# EAGLE design arcadeController (EAGLE 9.6.2)
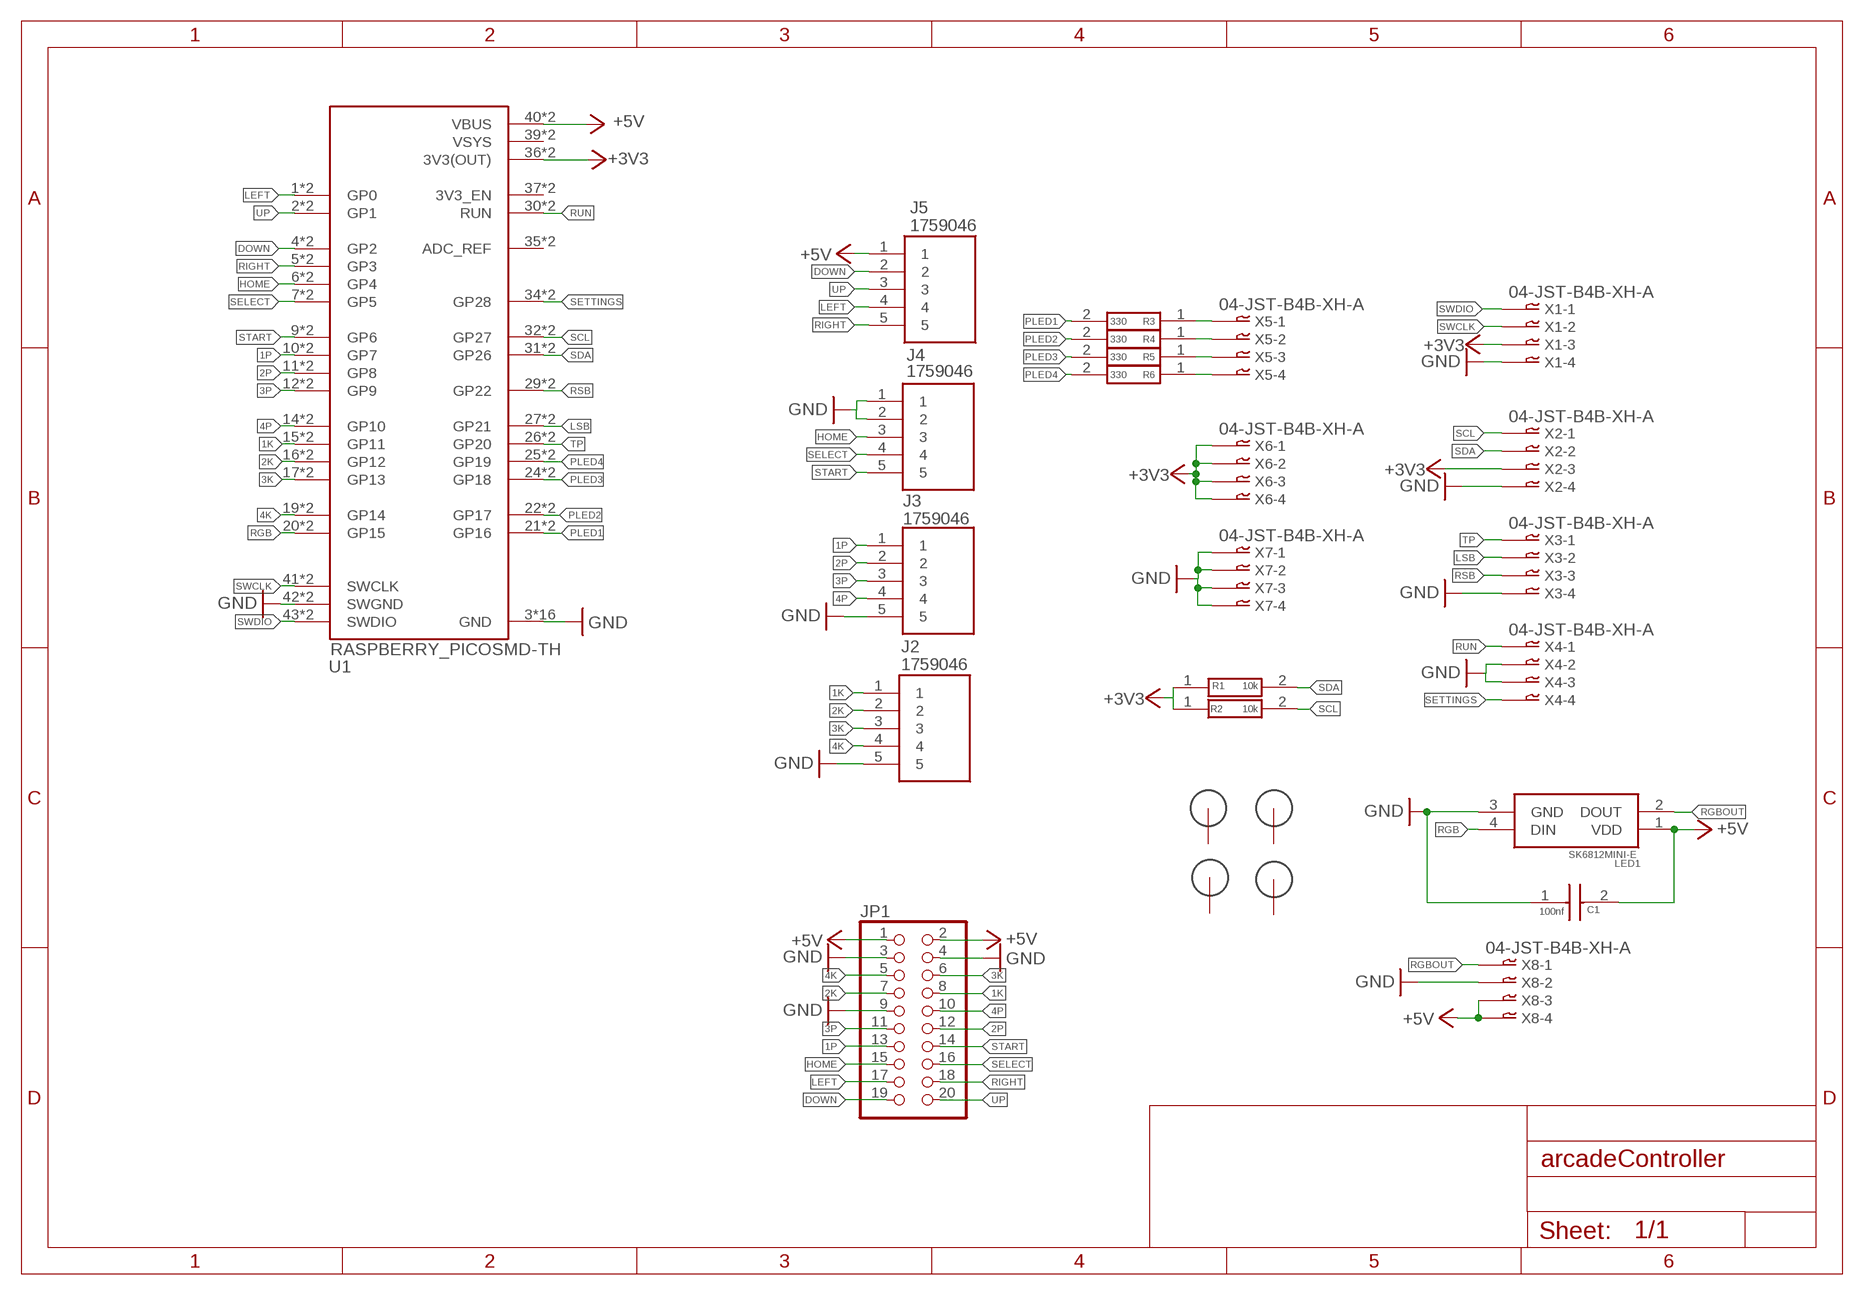
[diagram p0: schematic, sheet 1]

## Parts
C1  100nf  08055C104K4T2A  [CAPC2012X94N]
H1  3MM_HOLE  [3MM_HOLE]
H2  3MM_HOLE  [3MM_HOLE]
H3  3MM_HOLE  [3MM_HOLE]
H4  3MM_HOLE  [3MM_HOLE]
J2  1759046  [SHDRRA5W103P0X508_1X5_2540X120]
J3  1759046  [SHDRRA5W103P0X508_1X5_2540X120]
J4  1759046  [SHDRRA5W103P0X508_1X5_2540X120]
J5  1759046  [SHDRRA5W103P0X508_1X5_2540X120]
JP1  PINHD-2X10  [2X10]
LED1  SK6812MINI-E  [SK6812MINIE]
R1  10k  CHP0805-FX-1002ELF  [RESC2012X60N]
R2  10k  CHP0805-FX-1002ELF  [RESC2012X60N]
R3  330  CMP0603AFX-3300ELF  [RESC1608X55N]
R4  330  CMP0603AFX-3300ELF  [RESC1608X55N]
R5  330  CMP0603AFX-3300ELF  [RESC1608X55N]
R6  330  CMP0603AFX-3300ELF  [RESC1608X55N]
U1  RASPBERRY_PICOSMD-TH  [PICO-PKG]
X1  04-JST-B4B-XH-A  [B4B-XH]
X2  04-JST-B4B-XH-A  [B4B-XH]
X3  04-JST-B4B-XH-A  [B4B-XH]
X4  04-JST-B4B-XH-A  [B4B-XH]
X5  04-JST-B4B-XH-A  [B4B-XH]
X6  04-JST-B4B-XH-A  [B4B-XH]
X7  04-JST-B4B-XH-A  [B4B-XH]
X8  04-JST-B4B-XH-A  [B4B-XH]

## Nets
1K: J2.1 JP1.8 U1.15(GP11) U1.P$15(GP11)
1P: J3.1 JP1.13 U1.10(GP7) U1.P$10(GP7)
2K: J2.2 JP1.7 U1.16(GP12) U1.P$16(GP12)
2P: J3.2 JP1.12 U1.11(GP8) U1.P$11(GP8)
3K: J2.3 JP1.6 U1.17(GP13) U1.P$17(GP13)
3P: J3.3 JP1.11 U1.12(GP9) U1.P$12(GP9)
4K: J2.4 JP1.5 U1.19(GP14) U1.P$19(GP14)
4P: J3.4 JP1.10 U1.14(GP10) U1.P$14(GP10)
+3V3: R1.1 R2.1 U1.36(3V3(OUT)) U1.P$36(3V3(OUT)) X1.P$3 X2.P$3 X6.P$1 X6.P$2 X6.P$3 X6.P$4
+5V: C1.2 J5.1 JP1.1 JP1.2 LED1.1(VDD) U1.40(VBUS) U1.P$40(VBUS) X8.P$3 X8.P$4
DOWN: J5.2 JP1.19 U1.4(GP2) U1.P$4(GP2)
GND: C1.1 J2.5 J3.5 J4.1 J4.2 JP1.3 JP1.4 JP1.9 LED1.3(GND) U1.3(GND) U1.8(GND) U1.13(GND) U1.18(GND) U1.23(GND) U1.28(GND) U1.33(GND) U1.38(GND) U1.42(SWGND) U1.P$3(GND) U1.P$8(GND) U1.P$13(GND) U1.P$18(GND) U1.P$23(GND) U1.P$28(GND) U1.P$33(GND) U1.P$38(GND) U1.P$42(SWGND) X1.P$4 X2.P$4 X3.P$4 X4.P$2 X4.P$3 X7.P$1 X7.P$2 X7.P$3 X7.P$4 X8.P$2
HOME: J4.3 JP1.15 U1.6(GP4) U1.P$6(GP4)
LEFT: J5.4 JP1.17 U1.1(GP0) U1.P$1(GP0)
LSB: U1.27(GP21) U1.P$27(GP21) X3.P$2
N$21: R3.1 X5.P$1
N$22: R4.1 X5.P$2
N$23: R5.1 X5.P$3
N$24: R6.1 X5.P$4
PLED1: R3.2 U1.21(GP16) U1.P$21(GP16)
PLED2: R4.2 U1.22(GP17) U1.P$22(GP17)
PLED3: R5.2 U1.24(GP18) U1.P$24(GP18)
PLED4: R6.2 U1.25(GP19) U1.P$25(GP19)
RGB: LED1.4(DIN) U1.20(GP15) U1.P$20(GP15)
RGBOUT: LED1.2(DOUT) X8.P$1
RIGHT: J5.5 JP1.18 U1.5(GP3) U1.P$5(GP3)
RSB: U1.29(GP22) U1.P$29(GP22) X3.P$3
RUN: U1.30(RUN) U1.P$30(RUN) X4.P$1
SCL: R2.2 U1.32(GP27) U1.P$32(GP27) X2.P$1
SDA: R1.2 U1.31(GP26) U1.P$31(GP26) X2.P$2
SELECT: J4.4 JP1.16 U1.7(GP5) U1.P$7(GP5)
SETTINGS: U1.34(GP28) U1.P$34(GP28) X4.P$4
START: J4.5 JP1.14 U1.9(GP6) U1.P$9(GP6)
SWCLK: U1.41(SWCLK) U1.P$41(SWCLK) X1.P$2
SWDIO: U1.43(SWDIO) U1.P$43(SWDIO) X1.P$1
TP: U1.26(GP20) U1.P$26(GP20) X3.P$1
UP: J5.3 JP1.20 U1.2(GP1) U1.P$2(GP1)
Unconnected: H1.P$1(GND) H1.P$2(GND) H1.P$3(GND) H1.P$4(GND) H1.P$5(GND) H1.P$6(GND) H1.P$7(GND) H1.P$8(GND) H1.P$9(GND) H2.P$1(GND) H2.P$2(GND) H2.P$3(GND) H2.P$4(GND) H2.P$5(GND) H2.P$6(GND) H2.P$7(GND) H2.P$8(GND) H2.P$9(GND) H3.P$1(GND) H3.P$2(GND) H3.P$3(GND) H3.P$4(GND) H3.P$5(GND) H3.P$6(GND) H3.P$7(GND) H3.P$8(GND) H3.P$9(GND) H4.P$1(GND) H4.P$2(GND) H4.P$3(GND) H4.P$4(GND) H4.P$5(GND) H4.P$6(GND) H4.P$7(GND) H4.P$8(GND) H4.P$9(GND) U1.35(ADC_REF) U1.37(3V3_EN) U1.P$35(ADC_REF) U1.P$37(3V3_EN)

## Power pins joined to a net without a drawn wire
VSYS: U1.39(VSYS) U1.P$39(VSYS)

## Library data of the parts
C1 = 08055C104K4T2A:08055C104K4T2A: AVX - 08055C104K4T2A - SMD Multilayer Ceramic Capacitor, 0.1 F, 50 V, 0805 [2012 Metric], +/- 10%, X7R Source: Datasheet <https://componentsearchengine.com/Datasheets/2/08055C104K4T2A.pdf>; DESCRIPTION: AVX - 08055C104K4T2A - SMD Multilayer Ceramic Capacitor, 0.1 F, 50 V, 0805 [2012 Metric], +/- 10%, X7R; HEIGHT: 0.94mm; MANUFACTURER_NAME: Kyocera AVX; MANUFACTURER_PART_NUMBER: 08055C104K4T2A; MOUSER_PART_NUMBER: 581-08055C104K4; MOUSER_PRICE-STOCK: https://www.mouser.co.uk/ProductDetail/KYOCERA-AVX/08055C104K4T2A?qs=xMTsDkQFXIwOG0s%252Bx1urSg%3D%3D
H1-H4 = 3mm_special_hole:3MM_HOLE: Cool looking 3mm hole with ground connection
J2-J5 = 1759046:1759046: PCB header, nominal cross section: 2.5 mm?, color: green, nominal current: 12 A, rated voltage (III/2): 320 V, contact surface: Tin, type of contact: Male connector, Number of potentials: 5, Number of rows: 1, Number of positions per row: 5, number of connections: 5, product range: MSTB 2,5/..-G, pitch: 5.08 mm, mounting: Wave soldering, pin layout: Linear pinning, solder pin [P]: 3.2 mm, Stecksystem: CLASSIC COMBICON, Locking: without, type of packaging: packed in cardboard Source: Datasheet <http://www.phoenixcontact.com/de/produkte/1759046/pdf>; DESCRIPTION: PCB header, nominal cross section: 2.5 mm?, color: green, nominal current: 12 A, rated voltage (III/2): 320 V, contact surface: Tin, type of contact: Male connector, Number of potentials: 5, Number of rows: 1, Number of positions per row: 5, number of connections: 5, product range: MSTB 2,5/..-G, pitch: 5.08 mm, mounting: Wave soldering, pin layout: Linear pinning, solder pin [P]: 3.2 mm, Stecksystem: CLASSIC COMBICON, Locking: without, type of packaging: packed in cardboard; HEIGHT: 8.72mm; MANUFACTURER_NAME: Phoenix Contact; MANUFACTURER_PART_NUMBER: 1759046; MOUSER_PART_NUMBER: 651-1759046; MOUSER_PRICE-STOCK: https://www.mouser.co.uk/ProductDetail/Phoenix-Contact/1759046?qs=cyzODkzcbwC75vUJEckceg%3D%3D
JP1 = pinhead:PINHD-2X10: PIN HEADER
LED1 = SK6812MINI-E:SK6812MINI-E: 3.2x2.8x1.78 mm 0.2W Intelligent external control surface mount SMD LED (MSL:5a) Source: Datasheet <http://yushakobo.jp/ds/YS-SK6812MINI-E.pdf>; DESCRIPTION: 3.2x2.8x1.78 mm 0.2W Intelligent external control surface mount SMD LED (MSL:5a); HEIGHT: 1.88mm; MANUFACTURER_NAME: Yellow Stone Corp.; MANUFACTURER_PART_NUMBER: SK6812MINI-E
R1 R2 = CHP0805-FX-1002ELF:CHP0805-FX-1002ELF: Thick Film Resistors - SMD ResHighPower 0805 10k 1% 1/2W TC100 Source: Datasheet <https://ms.componentsearchengine.com/Datasheets/1/CHP0805-FX-1002ELF.pdf>; DESCRIPTION: Thick Film Resistors - SMD ResHighPower 0805 10k 1% 1/2W TC100; HEIGHT: 0.6mm; MANUFACTURER_NAME: Bourns; MANUFACTURER_PART_NUMBER: CHP0805-FX-1002ELF; MOUSER_PART_NUMBER: 652-CHP0805FX1002ELF; MOUSER_PRICE-STOCK: https://www.mouser.co.uk/ProductDetail/Bourns/CHP0805-FX-1002ELF?qs=lc2O%252BfHJPVaDI6gsPdDtfw%3D%3D
R3-R6 = CMP0603AFX-3300ELF:CMP0603AFX-3300ELF: Thick Film Resistors - SMD 330 OHM 1% 1/4W TC100 Source: Datasheet <https://www.bourns.com/docs/Product-Datasheets/CMP-A.pdf>; DESCRIPTION: Thick Film Resistors - SMD 330 OHM 1% 1/4W TC100; HEIGHT: 0.55mm; MANUFACTURER_NAME: Bourns; MANUFACTURER_PART_NUMBER: CMP0603AFX-3300ELF; MOUSER_PART_NUMBER: 652-CMP0603AFX-3300L; MOUSER_PRICE-STOCK: https://www.mouser.co.uk/ProductDetail/Bourns/CMP0603AFX-3300ELF?qs=TiOZkKH1s2QD9kDdDwF%252BdA%3D%3D
U1 = RpiPico:RASPBERRY_PICO: Raspberry Pi Pico
X1-X8 = bt_con-jst-xh:04-JST: JST CONNECTOR

## Board
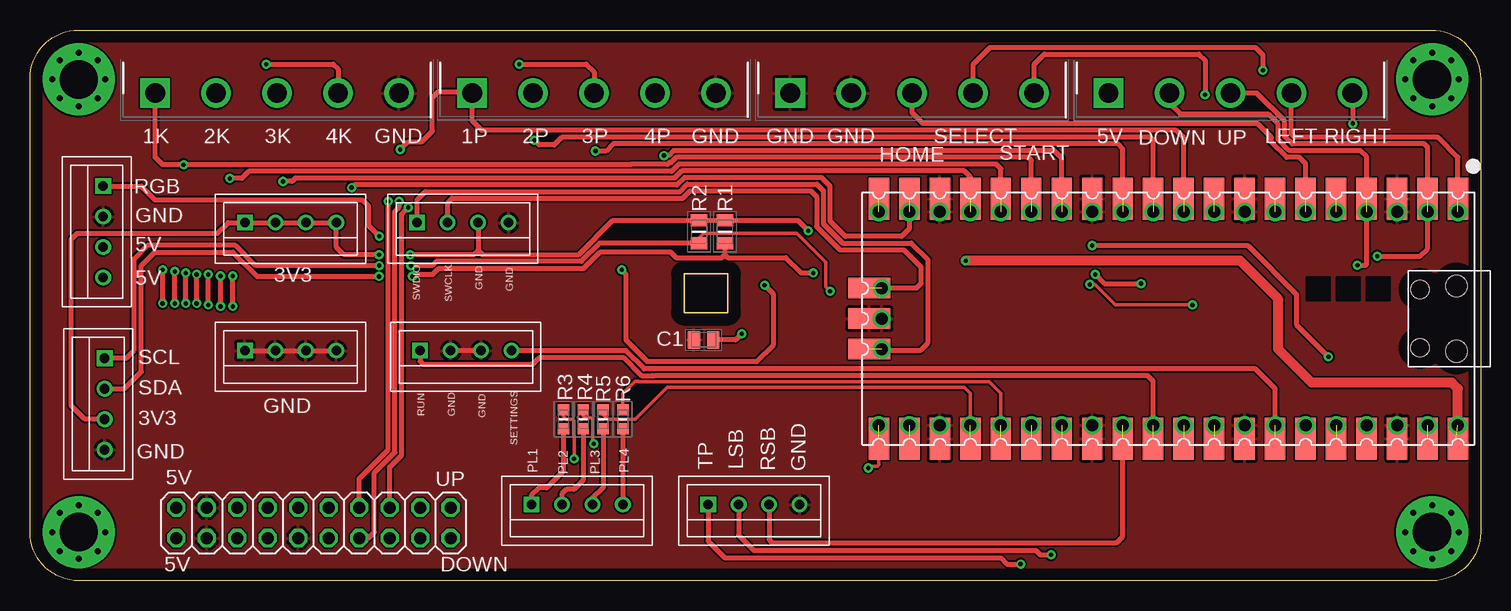
[diagram p1: board, top side]
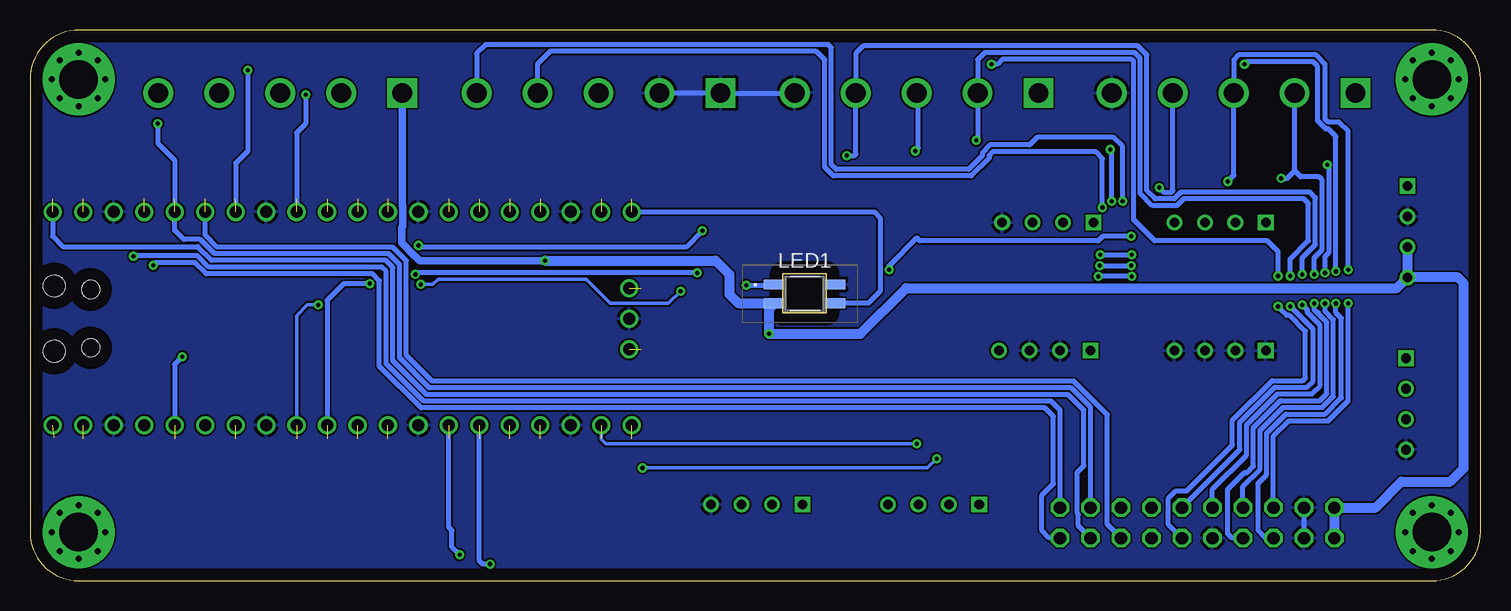
[diagram p2: board, bottom side, seen from below]

Size 120.89 x 45.9 mm. Coordinates in mm from the lower left corner, seen from the top.
Outline: 0,41.83 arc-90 4.06,45.9 116.78,45.9 arc-90 120.89,41.78 120.89,4.05 arc-90 116.84,0 4.06,0 arc-90 0,4.06 0,41.83
Copper layers (1*16): Top 0.035mm / dielectric 1.5mm / Bottom 0.035mm
Design rules "default *": minimum track width 6mil, minimum drill 0.35mm, track to track 6mil, track to pad 6mil, pad to pad 6mil, via to via 6mil, smd to smd 6mil, copper to edge 40mil, drill to drill 6mil, minimum pad ring 10mil, minimum via ring 8mil, stop-mask expansion 4mil, vias tented up to drill 0.36mm, thermal gap 10mil

### Footprints (pad centres in the part's own frame; a part is rotated, then mirrored left to right if it is on the bottom)
CAPC2012X94N = smd 1.02 x 1.47: 1 -0.81,0; 2 0.81,0
3MM_HOLE = drill 3.2 pad 6: P$1 0,0 | drill 0.5 pad 0.61: P$2 0,2.223; P$3 0,-2.223; P$4 2.223,0; P$5 -2.223,0; P$6 -1.587,1.587; P$7 1.587,1.587; P$8 1.587,-1.587; P$9 -1.587,-1.587
SHDRRA5W103P0X508_1X5_2540X120 = drill 1.65 pad 2.475 square: 1 0,0 | drill 1.65 pad 2.475: 2 5.08,0; 3 10.16,0; 4 15.24,0; 5 20.32,0
2X10 = drill 1.016 octagon: 1 -11.43,-1.27; 2 -11.43,1.27; 3 -8.89,-1.27; 4 -8.89,1.27; 5 -6.35,-1.27; 6 -6.35,1.27; 7 -3.81,-1.27; 8 -3.81,1.27; 9 -1.27,-1.27; 10 -1.27,1.27; 11 1.27,-1.27; 12 1.27,1.27; 13 3.81,-1.27; 14 3.81,1.27; 15 6.35,-1.27; 16 6.35,1.27; 17 8.89,-1.27; 18 8.89,1.27; 19 11.43,-1.27; 20 11.43,1.27
SK6812MINIE = smd 1.8 x 0.82: 1 -2.5,-0.774; 2 -2.5,0.774; 3 2.5,0.774; 4 2.5,-0.774
RESC2012X60N = smd 1 x 1.4: 1 -0.95,0; 2 0.95,0
RESC1608X55N = smd 0.9 x 0.95: 1 -0.8,0; 2 0.8,0
PICO-PKG = drill 1: 1 -8.89,24.13; 2 -8.89,21.59; 3 -8.89,19.05; 4 -8.89,16.51; 5 -8.89,13.97; 6 -8.89,11.43; 7 -8.89,8.89; 8 -8.89,6.35; 9 -8.89,3.81; 10 -8.89,1.27; 11 -8.89,-1.27; 12 -8.89,-3.81; 13 -8.89,-6.35; 14 -8.89,-8.89; 15 -8.89,-11.43; 16 -8.89,-13.97; 17 -8.89,-16.51; 18 -8.89,-19.05; 19 -8.89,-21.59; 20 -8.89,-24.13; 21 8.89,-24.13; 22 8.89,-21.59; 23 8.89,-19.05; 24 8.89,-16.51; 25 8.89,-13.97; 26 8.89,-11.43; 27 8.89,-8.89; 28 8.89,-6.35; 29 8.89,-3.81; 30 8.89,-1.27; 31 8.89,1.27; 32 8.89,3.81; 33 8.89,6.35; 34 8.89,8.89; 35 8.89,11.43; 36 8.89,13.97; 37 8.89,16.51; 38 8.89,19.05; 39 8.89,21.59; 40 8.89,24.13; 41 -2.54,-23.9; 42 0,-23.9; 43 2.54,-23.9 | smd 3.5 x 1.7: P$1 -10,24.13; P$2 -10,21.59; P$3 -10,19.05; P$4 -10,16.51; P$5 -10,13.97; P$6 -10,11.43; P$7 -10,8.89; P$8 -10,6.35; P$9 -10,3.81; P$10 -10,1.27; P$11 -10,-1.27; P$12 -10,-3.81; P$13 -10,-6.35; P$14 -10,-8.89; P$15 -10,-11.43; P$16 -10,-13.97; P$17 -10,-16.51; P$18 -10,-19.05; P$19 -10,-21.59; P$20 -10,-24.13; P$21 10,-24.13; P$22 10,-21.59; P$23 10,-19.05; P$24 10,-16.51; P$25 10,-13.97; P$26 10,-11.43; P$27 10,-8.89; P$28 10,-6.35; P$29 10,-3.81; P$30 10,-1.27; P$31 10,1.27; P$32 10,3.81; P$33 10,6.35; P$34 10,8.89; P$35 10,11.43; P$36 10,13.97; P$37 10,16.51; P$38 10,19.05; P$39 10,21.59; P$40 10,24.13 | smd 1.7 x 3.5: P$41 -2.54,-24.925; P$42 0,-24.925; P$43 2.54,-24.925 | hole 1.8: -2.725,24; 2.725,24 | hole 1.5: -2.425,20.97; 2.425,20.97
B4B-XH = drill 0.8 square: P$1 3.81,0 | drill 0.8: P$2 1.27,0; P$3 -1.27,0; P$4 -3.81,0

### Placement (x,y rotation side)
C1  56.13,20.07 0 top
H1  4.06,4.06 0 top
H2  116.84,41.78 0 top
H3  116.84,4.06 0 top
H4  4.06,41.78 0 top
J2  10.43,40.64 0 top
J3  36.84,40.65 0 top
J4  63.35,40.64 0 top
J5  89.88,40.64 0 top
JP1  23.62,4.83 0 top
LED1  56.35,23.91 0 bottom
R1  57.91,29.08 270 top
R2  55.75,29.08 270 top
R3  44.45,13.46 90 top
R4  46.1,13.46 90 top
R5  47.75,13.46 90 top
R6  49.4,13.46 90 top
U1  94.87,21.84 270 top
X1  36.07,29.84 180 top
X2  6.22,14.73 90 top
X3  60.33,6.35 180 top
X4  36.32,19.18 180 top
X5  45.59,6.35 180 top
X6  21.72,29.84 180 top
X7  21.72,19.18 180 top
X8  6.1,29.08 90 top

### Tracks (layer width: path | path; a pad name or v marks a point on that pad's centre or on a via)
1K  (via drill 0.35)  (1 unrouted)
  Top 0.406: U1.P$15 83.44,35.03 83.19,35.28 53.85,35.28 53.44,34.87 53.31,34.87 53.14,34.7 50.07,34.7 50.04,34.67 v12.8,34.67 11.05,34.67 10.43,35.29 J2.1 | v12.97,23.11 v12.97,25.65
  Bottom 0.406: JP1.8 19.81,7.87 18.39,9.3 18.39,12.53 16.47,14.45 13.19,14.45 12.27,15.37 12.27,21.77 12.97,22.47 v12.97,23.11 | v12.97,25.65 12.97,27.03 12.62,27.38 12.62,34.5 v12.8,34.67
1P  (via drill 0.35)  (1 unrouted)
  Top 0.406: U1.P$10 96.14,36.91 95.5,37.54 37.64,37.54 36.84,38.34 J3.1 36.73,40.77 34.04,40.77 33.53,40.26 33.53,37.47 32.64,36.58 31.5,36.58 v30.86,35.94 | JP1.13 28.19,3.56 28.7,4.06 28.7,8.99 30.4,10.69 30.4,30.79 30.75,31.13 v30.75,31.62
  Bottom 0.406: v30.86,35.94 30.75,35.83 v30.75,31.62
2K  (via drill 0.35)  (1 unrouted)
  Top 0.406: U1.P$16 80.9,34.34 80.52,34.72 54.08,34.72 53.47,34.11 18.24,34.11 17.65,33.53 v16.64,33.53 | v13.88,23.11 v13.88,25.53
  Bottom 0.406: v16.64,33.53 16.13,33.53 15.51,34.15 | 15.51,34.15 J2.2 | JP1.7 20.7,3.56 21.08,3.94 21.08,7.62 19.69,9.02 19.46,9.02 18.95,9.53 18.95,12.76 16.7,15.01 13.42,15.01 12.83,15.6 12.83,21.54 13.53,22.24 | 13.53,22.24 13.53,22.35 | 13.53,22.24 13.88,22.59 v13.88,23.11 | v13.88,25.53 13.88,26.91 13.21,27.59 13.21,33.4 13.46,33.66 15.01,33.66 15.51,34.15
2P  (via drill 0.35)  (1 unrouted)
  Top 0.406: U1.P$11 93.6,36.7 93.35,36.96 44.32,36.96 43.69,36.32 42.42,36.32 v42.04,36.7 | v15.88,22.86 v15.88,25.4
  Bottom 0.406: v42.04,36.7 41.92,36.82 J3.2 41.92,43.42 41.33,44.02 28.83,44.02 28.37,43.56 28.37,32.28 27.36,31.27 25.32,31.27 24.76,31.83 14.73,31.83 14.35,31.45 14.35,28.32 15.88,26.8 v15.88,25.4 | JP1.12 20.07,10.92 20.07,13.22 17.16,16.13 14.48,16.13 13.97,16.64 13.97,20.95 v15.88,22.86
3K  (via drill 0.35)  (1 unrouted)
  Top 0.406: U1.P$17 78.36,33.66 77.85,34.16 54.31,34.16 53.7,33.55 22.12,33.55 21.84,33.27 v21.08,33.27 | v11.05,23.11 v11.05,25.91
  Bottom 0.406: v21.08,33.27 20.57,33.78 20.57,40.63 | 20.57,40.63 J2.3 | JP1.6 17.27,12.06 16,13.34 12.7,13.34 11.05,14.99 v11.05,23.11 | v11.05,25.91 11.05,37.47 11.81,38.23 12.7,38.23 12.95,38.48 12.95,43.05 13.72,43.81 20.19,43.81 20.57,43.43 20.57,40.63
3P  (via drill 0.35)  (1 unrouted)
  Top 0.406: U1.P$12 91.06,36.02 90.68,36.4 48.59,36.4 48.01,35.81 v47.12,35.81 | v16.89,22.86 v16.89,25.4 | v40.77,43.05 46.36,43.05 47,42.41 J3.3
  Bottom 0.406: v47.12,35.81 46.86,36.07 46.86,40.51 J3.3 | JP1.11 26.03,4.7 26.03,6.86 25.4,7.49 24.51,7.49 20.7,11.3 20.7,13.38 17.39,16.69 14.81,16.69 14.6,16.89 14.6,20.8 15.93,22.13 16.18,22.13 16.61,22.56 16.61,22.58 v16.89,22.86 | v16.89,25.4 16.89,27.43 17.78,28.32 27.18,28.32 28.93,30.07 28.93,43.33 29.06,43.46 39.85,43.46 40.26,43.05 v40.77,43.05
4K  (via drill 0.35)  (1 unrouted)
  Top 0.406: U1.P$19 73.28,29.34 72.64,28.7 67.95,28.7 66.67,29.97 66.67,32.89 65.96,33.6 54.55,33.6 53.94,32.99 27.03,32.99 v26.8,32.77 | v12.06,23.11 v12.06,25.78 | v19.69,43.05 25.27,43.05 25.67,42.66 J2.4
  Bottom 0.406: v26.8,32.77 26.42,32.38 25.78,32.38 25.65,32.51 25.65,40.63 J2.4 | JP1.5 17.91,3.56 18.54,4.19 18.54,8.13 17.83,8.84 17.83,12.3 16.23,13.89 12.95,13.89 11.61,15.24 11.61,21.9 12.06,22.35 v12.06,23.11 | v12.06,25.78 12.06,37.03 12.7,37.67 12.93,37.67 13.59,38.33 13.59,42.88 13.97,43.26 19.48,43.26 v19.69,43.05
4P  (via drill 0.35)  (1 unrouted)
  Top 0.406: U1.P$14 85.98,35.2 85.34,35.84 53.62,35.84 53.21,35.43 v52.83,35.43 | v14.86,22.99 v14.86,25.53
  Bottom 0.406: v52.83,35.43 52.2,35.43 52.07,35.56 52.07,40.39 52.07,40.64 | 52.07,40.64 J3.4 | JP1.10 22.35,7.62 19.51,10.47 19.51,12.99 16.93,15.57 14.07,15.57 13.39,16.26 13.39,21.3 14.44,22.36 14.44,22.57 v14.86,22.99 | v14.86,25.53 14.86,26.92 13.77,28.02 13.77,31.93 14.22,32.38 24.99,32.38 25.55,31.83 27.13,31.83 27.81,32.51 27.81,43.81 28.58,44.58 51.44,44.58 52.07,43.94 52.07,40.64
+3V3  (via drill 0.35)  (1 unrouted)
  Top 0.406: X1.P$3 37.34,27.56 | v31.7,27.18 36.96,27.18 37.34,27.56 | v29.08,27.18 26.16,27.18 25.53,27.81 X6.P$4 X6.P$3 X6.P$2 X6.P$1 16.51,29.84 15.62,28.96 3.94,28.96 3.43,28.45 3.43,14.61 4.57,13.46 X2.P$3 | 37.34,27.56 37.72,27.18 45.72,27.18 48.58,30.03 R2.1 R1.1 64,30.03 v64.86,29.17 | v88.52,27.94 101.47,27.94 105.54,23.88 105.54,21.34 v108.2,18.67
  Bottom 0.406: v31.7,27.18 v29.08,27.18 | v64.86,29.17 66.22,27.81 88.39,27.81 v88.52,27.94 | v108.2,18.67 108.84,18.03 U1.36
+5V  (via drill 0.35)  (1 unrouted)
  Top 0.406: v59.31,20.57 58.8,20.07 C1.2 | 118.87,11.97 U1.P$40
  Top 0.813: U1.P$40 119,16 118.49,16.51 106.81,16.51 104.01,19.3 104.01,23.49 100.84,26.67 v77.98,26.67
  Bottom 0.61: J5.1 89.88,31.27 89.85,31.24 89.85,29.53 89.92,29.46 89.92,28.16 88.86,27.11 88.83,27.11 88.39,26.67 v77.98,26.67
  Bottom 0.813: v77.98,26.67 63.75,26.67 62.61,25.53 62.61,23.88 61.88,23.14 LED1.1 59.31,22.68 v59.31,20.57 51.69,20.57 47.88,24.38 6.98,24.38 X8.P$4 | X8.P$4 X8.P$3 | JP1.1 JP1.2 8.76,6.1 6.6,8.26 2.54,8.26 1.42,9.37 1.42,24.79 1.91,25.27 X8.P$4
DOWN  (via drill 0.35)  (1 unrouted)
  Top 0.406: U1.P$4 111.38,35.33 110.87,35.84 104.95,35.84 104,36.79 104,38.08 103.22,38.86 95.89,38.86 94.96,39.79 J5.2 | v110.62,26.29 111.25,26.29 111.38,26.42 U1.4
  Bottom 0.406: JP1.19 35.94,3.56 36.58,4.19 36.58,7.11 35.61,8.08 35.61,13.69 36.32,14.4 88.3,14.4 91.77,17.87 91.77,25.02 92.33,25.58 106.21,25.58 107.14,26.51 110.39,26.51 v110.62,26.29
GND
  Top 0.406: X4.P$3 X4.P$2 | X7.P$4 X7.P$3 X7.P$2 X7.P$1
  Bottom 0.406: J4.2 J4.1 57.17,40.64 J3.5 | JP1.4 JP1.3
  pour Top: 0.51,46.74 123.32,46.74 123.32,31.75 123.32,-1.27 114.68,-1.27 -1.78,-1.27 -1.78,16.89 -1.78,46.74
  pour Bottom: -1.78,46.74 123.32,46.74 123.32,37.21 123.32,-1.27 117.6,-1.27 -1.78,-1.27 -1.78,3.68
HOME  (1 unrouted)
  Top 0.406: U1.P$6 106.3,34.77 105.79,35.28 104.72,35.28 103.44,36.56 103.44,36.96 102.3,38.1 74.42,38.1 73.51,39.01 J4.3
  Bottom 0.406: JP1.15 31.11,4.7 31.11,13.84 33.91,16.64 87.38,16.64 89.54,18.8 89.54,26.67 90.68,27.81 105.28,27.81 106.3,28.83 U1.6
LEFT  (1 unrouted)
  Top 0.406: U1.P$1 119,35.31 117.35,36.96 105.41,36.96 105.12,37.25 J5.4
  Bottom 0.406: JP1.17 33.53,4.57 33.53,5.53 33.63,5.63 33.63,9.04 33.07,9.6 33.07,14.22 34.37,15.52 87.84,15.52 90.65,18.33 90.65,26.11 91.24,26.7 105.75,26.7 106.9,27.85 118.14,27.85 119,28.7 U1.1
LSB  (via drill 0.35)  (1 unrouted)
  Top 0.406: X3.P$2 59.06,3.81 60.33,2.54 83.82,2.54 84.2,2.16 v85.09,2.16
  Bottom 0.406: v85.09,2.16 85.72,2.79 85.72,4.19 85.98,4.45 U1.27
N$21
  Top 0.406: R3.1 44.45,9.14 43.05,7.75 42.42,7.75 41.78,7.11 X5.P$1
N$22
  Top 0.406: R4.1 46.1,8.38 45.34,7.62 44.7,7.62 44.32,7.24 X5.P$2
N$23
  Top 0.406: R5.1 47.75,7.75 46.86,6.86 X5.P$3
N$24
  Top 0.406: R6.1 X5.P$4
PLED1  (via drill 0.35)  (1 unrouted)
  Top 0.305: U1.P$21 70.74,9.65 70.61,9.52 69.85,9.52 v69.85,9.4 | v45.34,10.16 45.34,12.07 45.32,12.09 45.32,13.35 45.21,13.46 44.7,13.46 44.45,13.72 R3.2
  Bottom 0.305: v69.85,9.4 46.1,9.4 v45.34,10.16
PLED2  (via drill 0.35)  (1 unrouted)
  Top 0.305: R4.2 46.1,13.72 46.23,13.59 46.74,13.59 46.88,13.44 46.88,11.54 v46.99,11.43
  Bottom 0.305: v46.99,11.43 72.9,11.43 73.28,11.81 U1.22
PLED3  (1 unrouted)
  Top 0.305: U1.P$24 78.36,15.62 77.85,16.13 53.09,16.13 50.42,13.46 48.13,13.46 47.75,13.84 R5.2
PLED4  (1 unrouted)
  Top 0.305: U1.P$25 80.9,15.62 79.93,16.59 50.74,16.59 50.69,16.64 50.42,16.64 49.4,15.62 R6.2
RGB  (1 unrouted)
  Bottom 0.152: 53.24,23.37 53.19,23.37 52.96,23.14 53.36,23.14 LED1.4
  Bottom 0.406: U1.20 50.55,30.73 50.04,30.23 50.04,24.13 51.03,23.14 52.45,23.14 52.96,23.14 53.24,23.14 53.24,23.37
RGBOUT  (via drill 0.35)
  Top 0.406: X8.P$1 9.27,32.89 10.41,31.75 27.69,31.75 28.19,31.24 28.19,29.62 v29.11,28.7 | v49.3,25.91 49.66,25.55 49.66,20.07 51.44,18.29 60.58,18.29 61.98,19.69 61.98,23.88 v61.21,24.64
  Bottom 0.305: 59.43,24.54 59.38,24.59 59.38,24.69 59.43,24.64 | LED1.2 59.43,24.69
  Bottom 0.406: v29.11,28.7 31.5,28.7 31.88,28.32 46.74,28.32 46.99,28.58 49.3,26.26 v49.3,25.91 | v61.21,24.64 59.48,24.64 59.43,24.69 59.43,24.64
RIGHT  (via drill 0.35)  (1 unrouted)
  Top 0.406: J5.5 110.24,40.6 v110.24,38.1
  Bottom 0.406: v110.24,38.1 110.24,36.45 108.84,35.05 U1.5 108.84,29.21 108.08,28.45 106.71,28.45 105.51,27.25 91.01,27.25 90.09,26.34 90.09,18.56 87.61,16.08 34.14,16.08 32.51,14.45 JP1.18
RSB  (1 unrouted)
  Top 0.406: X3.P$3 61.59,3.43 61.85,3.17 90.55,3.17 91.06,3.68 U1.P$29
RUN  (1 unrouted)
  Top 0.406: X4.P$1 32.51,18.29 32.77,18.03 41.91,18.03 42.49,18.62 49.43,18.62 50.95,17.09 51.82,17.09 52.07,17.09 93.14,17.09 93.6,16.64 U1.P$30
SCL  (via drill 0.35)  (1 unrouted)
  Top 0.305: v96.87,22.99 90.42,22.99 88.72,24.69 v88.32,24.69 | v66.67,24.13 66.29,24.51 66.29,26.54 63.88,28.96 56.13,28.96 55.75,28.58 R2.2
  Top 0.406: R2.2 47.47,28.13 45.95,26.62 33.86,26.62 33.51,26.27 v31.75,26.27 | v29.11,26.27 18.82,26.27 17.15,27.94 9.78,27.94 8.64,26.8 8.64,19.18 8,18.54 X2.P$1
  Bottom 0.305: U1.32 98.68,22.1 97.79,22.99 v96.87,22.99 | v88.32,24.69 87.32,24.69 86.87,25.15 74.55,25.15 72.52,23.11 67.69,23.11 v66.67,24.13
  Bottom 0.406: v31.75,26.27 v29.11,26.27
SDA  (via drill 0.35)  (1 unrouted)
  Top 0.406: X2.P$2 7.87,16 9.27,17.4 9.27,26.24 10.41,27.38 16.91,27.38 18.93,25.36 v29.08,25.36 | v31.88,25.36 32.05,25.54 33.56,25.54 34.06,26.04 46.16,26.04 47.53,27.4 53.37,27.4 53.85,26.92 57.66,26.92 57.91,27.18 | R1.2 57.91,27.18 | 57.91,27.18 58.17,26.92 62.99,26.92 64.26,25.65 v65.28,25.65 | v88.77,25.53 89.54,24.77 v92.58,24.77
  Bottom 0.406: v29.08,25.36 v31.88,25.36 | v65.28,25.65 88.65,25.65 v88.77,25.53 | v92.58,24.77 94.74,24.77 96.14,23.37 U1.31
SELECT  (via drill 0.35)  (1 unrouted)
  Top 0.406: J4.4 78.59,43.03 80.01,44.45 102.11,44.45 102.74,43.81 v102.74,42.55 | v31.52,31.11 30.96,30.55 30.96,10.46 29.97,9.47 JP1.16
  Bottom 0.406: v102.74,42.55 102.74,35.81 103.76,34.8 U1.7 | v31.52,31.11 31.52,35.21 32.05,35.74 40.69,35.74 40.97,35.46 40.97,35.2 42.44,33.73 53.95,33.73 54.66,34.44 54.66,43.41 55.37,44.12 77.55,44.12 78.61,43.05 78.61,40.67 J4.4
SETTINGS  (1 unrouted)
  Top 0.406: U1.P$34 103.76,16 102.11,17.65 51.18,17.65 49.66,19.18 X4.P$4
START  (via drill 0.35)  (1 unrouted)
  Top 0.406: J4.5 83.67,43.03 84.53,43.89 97.41,43.89 97.92,43.38 v97.92,40.51 | JP1.14 27.43,8.51 29.84,10.92 v29.84,31.62
  Bottom 0.406: v97.92,40.51 97.92,38.1 98.68,37.34 U1.9 | J4.5 83.67,43.94 82.93,44.68 54.36,44.68 54.1,44.42 54.1,34.67 53.72,34.29 42.67,34.29 41.53,35.43 41.53,35.69 40.89,36.32 37.59,36.32 36.96,36.96 30.61,36.96 29.84,36.2 v29.84,31.62
SWCLK  (1 unrouted)
  Top 0.406: X1.P$2 34.8,31.5 35.18,31.88 54.4,31.88 55.01,32.49 65.08,32.49 65.56,32 65.56,29.51 67.48,27.58 72.82,27.58 74.24,26.16 74.24,24.77 73.86,24.38 U1.41
SWDIO  (1 unrouted)
  Top 0.406: X1.P$1 32.26,31.75 32.94,32.44 54.17,32.44 54.78,33.05 65.58,33.05 66.12,32.51 66.12,29.74 67.71,28.14 73.46,28.14 74.8,26.8 74.8,19.81 74.17,19.18 71.1,19.18 U1.43
TP  (via drill 0.35)  (1 unrouted)
  Top 0.406: X3.P$1 56.52,3.3 57.91,1.91 80.9,1.91 81.41,1.39 v82.55,1.39
  Bottom 0.406: v82.55,1.39 83.18,1.39 83.44,1.65 U1.26
UP  (via drill 0.35)  (1 unrouted)
  Top 0.406: U1.P$2 116.46,36.14 116.2,36.4 105.18,36.4 104.56,37.02 104.56,38.32 102.23,40.64 J5.3 | v112.27,27.05 115.82,27.05 116.46,27.69 U1.2
  Bottom 0.406: JP1.20 35.05,14.22 35.79,14.96 46.1,14.96 46.36,14.96 88.07,14.96 91.21,18.1 91.21,25.78 91.57,26.14 105.98,26.14 106.91,27.07 112.25,27.07 v112.27,27.05
VSYS  (1 unrouted)

### Text on the board
tPlace: 1K | 2K | 3K | 4K | GND | 1P | 2P | 3P | 4P | GND | GND | GND | SELECT | 5V | DOWN | UP | LEFT | RIGHT | HOME | START | RGB | GND | 5V | 5V | 3V3 | GND | GND | SWDIO | SWCLK | SCL | SDA | GND | 3V3 | RUN | GND | GND | SETTINGS | GND | PL1 | PL4 | TP | LSB | RSB | GND | 5V | PL2 | PL3 | UP | 5V | DOWN